# EAGLE schematic gemschematic_Chris_edits (EAGLE 9.6.2)
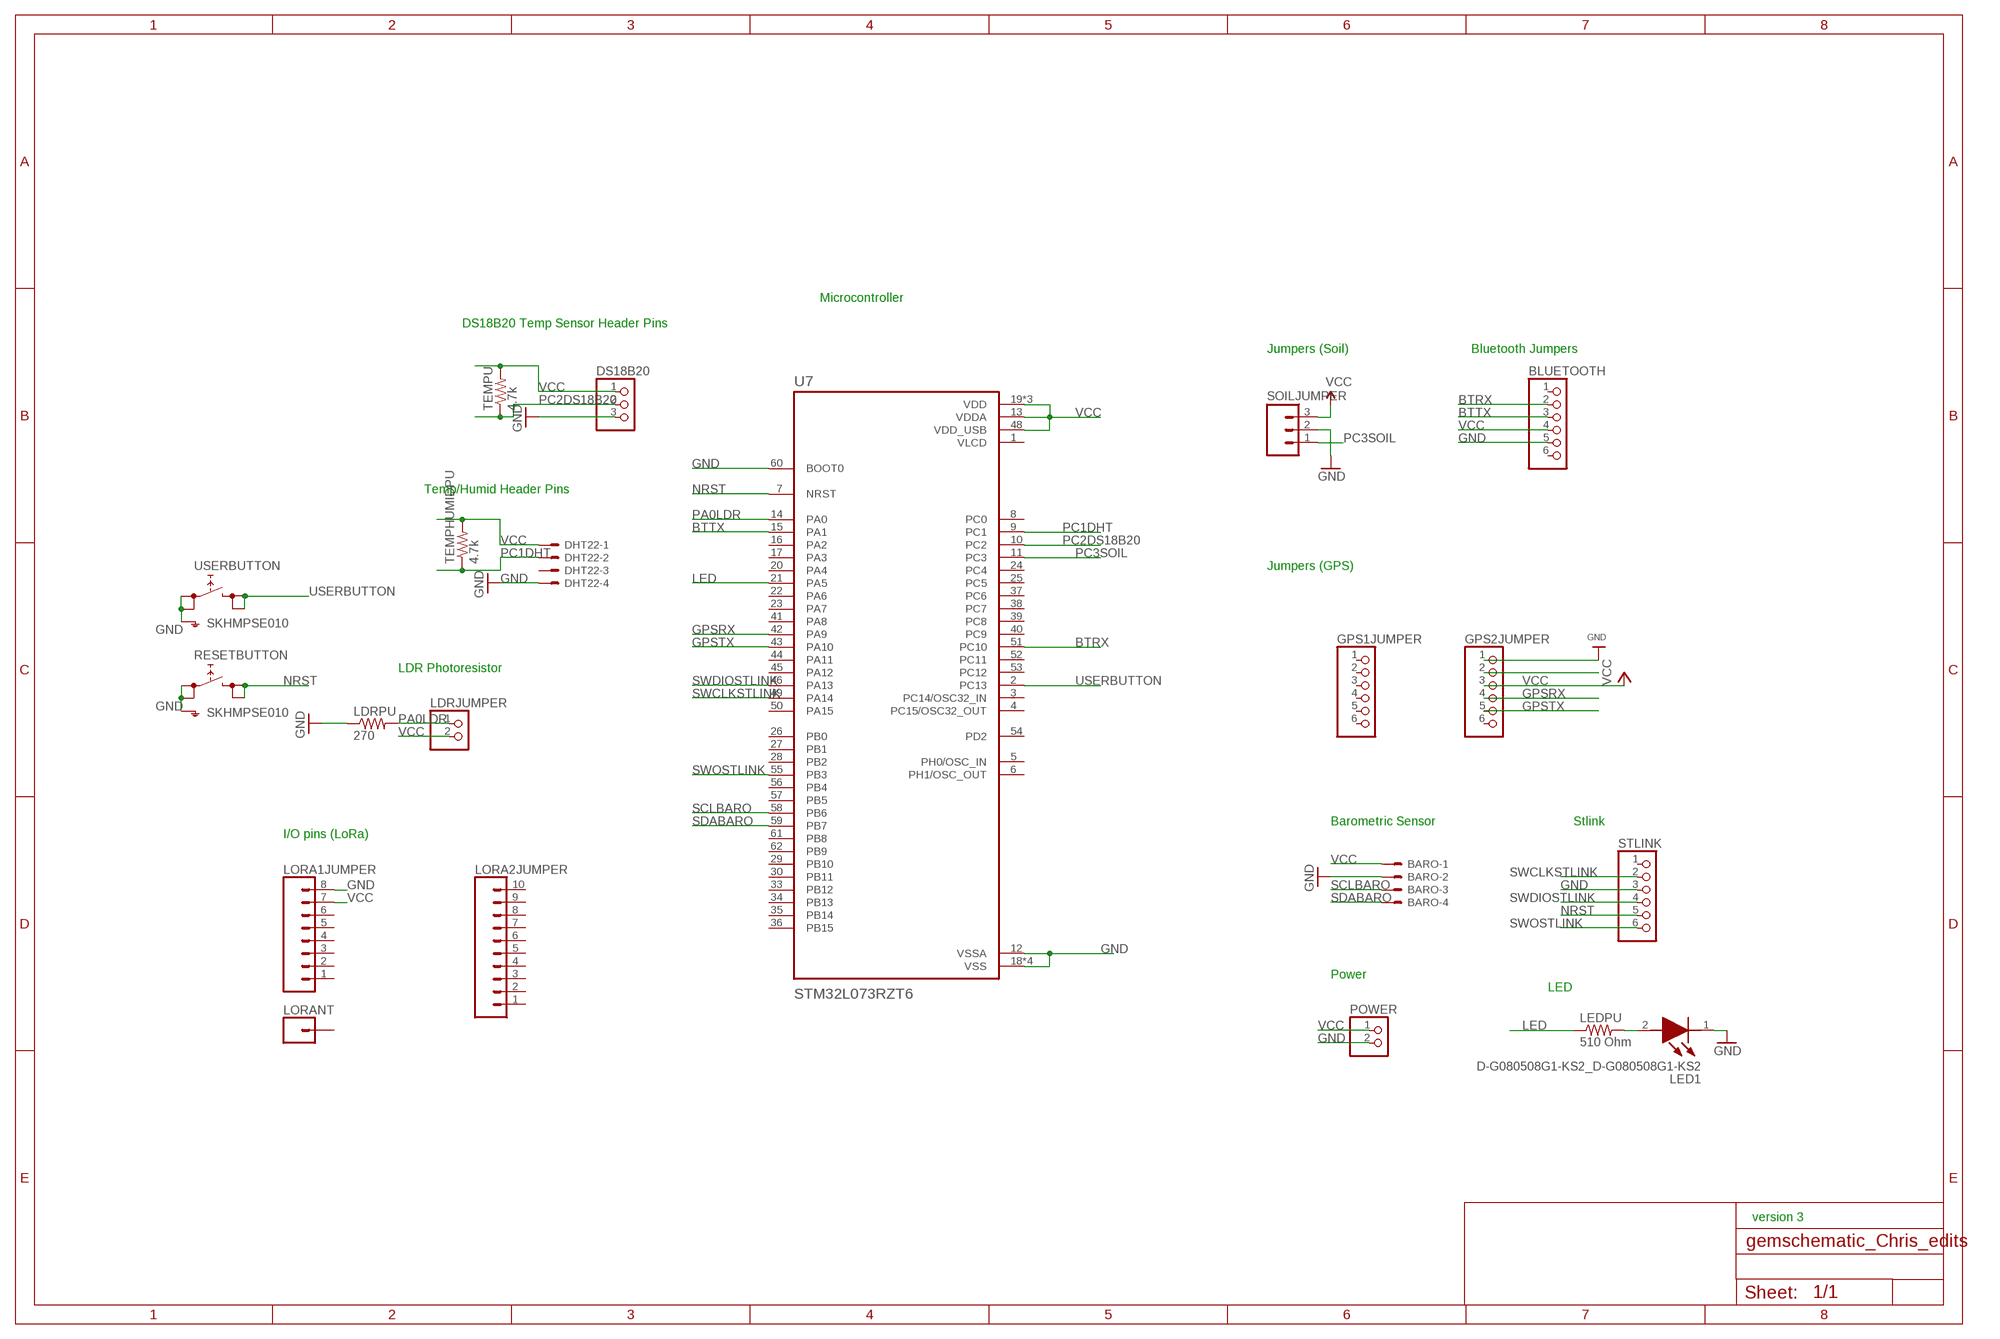
[diagram p0: schematic, sheet 1]

## Parts
BARO  22-23-2041  [22-23-2041]
BLUETOOTH  PINHD-1X6  [1X06]
DHT22  22-23-2041  [22-23-2041]
DS18B20  PINHD-1X3  [1X03]
GPS1JUMPER  HEADER-1X670MIL  [1X06_ROUND_70]
GPS2JUMPER  HEADER-1X670MIL  [1X06_ROUND_70]
LDRJUMPER  PINHD-1X2  [1X02]
LDRPU  270  R-US_M0805  [M0805]
LED1  D-G080508G1-KS2_D-G080508G1-KS2  [D-G080508G1-KS2_LEDC2012X85N]
LEDPU  510 Ohm  R-US_M0805  [M0805]
LORA1JUMPER  CONN_08NO_SILK_FEMALE_PTH  [1X08_NO_SILK]
LORA2JUMPER  CONN_10NO_SILK_PTH_FEMALE  [1X10_NO_SILK]
LORANT  CONN_01PTH_NO_SILK_YES_STOP  [1X01_NO_SILK]
POWER  PINHD-1X2  [1X02]
RESETBUTTON  SKHMPSE010  [SKHMPXE010]
SOILJUMPER  M03SCREW_LOCK  [SCREWTERMINAL-3.5MM-3_LOCK.007S]
STLINK  PINHD-1X6  [1X06]
TEMPHUMIDPU  4.7k  R-US_M0805  [M0805]
TEMPU  4.7k  R-US_M0805  [M0805]
U7  STM32L073RZT6  [QFP50P1200X1200X160-64N]
USERBUTTON  SKHMPSE010  [SKHMPXE010]

## Nets
1PPS: GPS2JUMPER.2
BTRX: BLUETOOTH.2 U7.51(PC10)
BTTX: BLUETOOTH.3 U7.15(PA1)
GND: BARO.2 BLUETOOTH.5 DHT22.4 DS18B20.3 GPS2JUMPER.1 LDRPU.1 LED1.1(K) LORA1JUMPER.8 POWER.2 RESETBUTTON.1(1.1) RESETBUTTON.2(1.2) RESETBUTTON.5(SH) SOILJUMPER.2 STLINK.3 U7.12(VSSA) U7.18(VSS) U7.31(VSS) U7.47(VSS) U7.60(BOOT0) U7.63(VSS) USERBUTTON.1(1.1) USERBUTTON.2(1.2) USERBUTTON.5(SH)
GPSRX: GPS2JUMPER.4 U7.42(PA9)
GPSTX: GPS2JUMPER.5 U7.43(PA10)
LED: LEDPU.1 U7.21(PA5)
N$1: LED1.2(A) LEDPU.2
NRST: RESETBUTTON.3(2.1) RESETBUTTON.4(2.2) STLINK.5 U7.7(NRST)
PA0LDR: LDRJUMPER.1 LDRPU.2 U7.14(PA0)
PC1DHT: DHT22.2 TEMPHUMIDPU.1 U7.9(PC1)
PC2DS18B20: DS18B20.2 TEMPU.1 U7.10(PC2)
PC3SOIL: SOILJUMPER.1 U7.11(PC3)
SCLBARO: BARO.3 U7.58(PB6)
SDABARO: BARO.4 U7.59(PB7)
SWCLKSTLINK: STLINK.2 U7.49(PA14)
SWDIOSTLINK: STLINK.4 U7.46(PA13)
SWOSTLINK: STLINK.6 U7.55(PB3)
USERBUTTON: U7.2(PC13) USERBUTTON.3(2.1) USERBUTTON.4(2.2)
VCC: BARO.1 BLUETOOTH.4 DHT22.1 DS18B20.1 GPS2JUMPER.3 LDRJUMPER.2 LORA1JUMPER.7 POWER.1 SOILJUMPER.3 TEMPHUMIDPU.2 TEMPU.2 U7.13(VDDA) U7.19(VDD) U7.32(VDD) U7.48(VDD_USB) U7.64(VDD)
Unconnected: BLUETOOTH.1 BLUETOOTH.6 DHT22.3 GPS1JUMPER.1 GPS1JUMPER.2 GPS1JUMPER.3 GPS1JUMPER.4 GPS1JUMPER.5 GPS1JUMPER.6 GPS2JUMPER.6 LORA1JUMPER.1 LORA1JUMPER.2 LORA1JUMPER.3 LORA1JUMPER.4 LORA1JUMPER.5 LORA1JUMPER.6 LORA2JUMPER.1 LORA2JUMPER.2 LORA2JUMPER.3 LORA2JUMPER.4 LORA2JUMPER.5 LORA2JUMPER.6 LORA2JUMPER.7 LORA2JUMPER.8 LORA2JUMPER.9 LORA2JUMPER.10 LORANT.1 STLINK.1 U7.3(PC14/OSC32_IN) U7.4(PC15/OSC32_OUT) U7.5(PH0/OSC_IN) U7.6(PH1/OSC_OUT) U7.8(PC0) U7.16(PA2) U7.17(PA3) U7.20(PA4) U7.22(PA6) U7.23(PA7) U7.24(PC4) U7.25(PC5) U7.26(PB0) U7.27(PB1) U7.28(PB2) U7.29(PB10) U7.30(PB11) U7.33(PB12) U7.34(PB13) U7.35(PB14) U7.36(PB15) U7.37(PC6) U7.38(PC7) U7.39(PC8) U7.40(PC9) U7.41(PA8) U7.44(PA11) U7.45(PA12) U7.50(PA15) U7.52(PC11) U7.53(PC12) U7.54(PD2) U7.56(PB4) U7.57(PB5) U7.61(PB8) U7.62(PB9)

## Notes on the sheet
- Microcontroller
- DS18B20 Temp Sensor Header Pins
- Jumpers (Soil) | Bluetooth Jumpers
- Temp/Humid Header Pins
- Jumpers (GPS)
- LDR Photoresistor
- Barometric Sensor | Stlink
- I/O pins (LoRa)
- Power
- LED
- version 3

## Power pins joined to a net without a drawn wire
VLCD: U7.1(VLCD)

## Library data of the parts
BARO DHT22 = con-molex:22-23-2041: .100" (2.54mm) Center Header - 4 Pin; MF: MOLEX; MPN: 22-23-2041; OC_FARNELL: 1462920; OC_NEWARK: 38C0355
BLUETOOTH STLINK = adafruit:PINHD-1X6: PIN HEADER
DS18B20 = adafruit:PINHD-1X3: PIN HEADER
GPS1JUMPER GPS2JUMPER = microbuilder:HEADER-1X6: PIN HEADER
LDRJUMPER POWER = pinhead:PINHD-1X2: PIN HEADER
LDRPU LEDPU TEMPHUMIDPU TEMPU = adafruit:R-US_: RESISTOR, American symbol
LED1 = ce-capstone-2022:D-G080508G1-KS2_D-G080508G1-KS2: Light Emitting Diodes (LED) Green 526~531nm 250~330mcd@5mA Top View 0805 RoHS Source: Datasheet <https://datasheet.lcsc.com/szlcsc/Wuxi-ARK-Tech-Elec-D-G080508G1-KS2_C107402.pdf>; DESCRIPTION: Light Emitting Diodes (LED) Green 526~531nm 250~330mcd@5mA Top View 0805 RoHS; HEIGHT: 0.85mm; MANUFACTURER_NAME: Wuxi ARK Tech Elec; MANUFACTURER_PART_NUMBER: D-G080508G1-KS2
LORA1JUMPER = SparkFun-Connectors:CONN_08: Multi connection point. Often used as Generic Header-pin footprint for 0.1 inch spaced/style header connections On any of the 0.1 inch spaced packages, you can populate with these: Break Away Headers - Straight <https://www.sparkfun.com/products/116> (PRT-00116) Break Away Male Headers - Right Angle <https://www.sparkfun.com/products/553> (PRT-00553) Female Headers <https://www.sparkfun.com/products/115> (PRT-00115) Break Away Headers - Machine Pin <https://www.sparkfun.com/products/117> (PRT-00117) Break Away Female Headers - Swiss Machine Pin <https://www.sparkfun.com/products/743> (PRT-00743) Arduino Stackable Header - 8 Pin <https://www.sparkfun.com/products/9279> (PRT-09279) For SCREWTERMINALS and SPRING TERMINALS visit here: Screw Terimnals on SparkFun.com <https://www.sparkfun.com/search/results?term=Screw+Terminals> (5mm/3.5mm/2.54mm spacing) This device is also useful as a general connection point to wire up your design to another part of your project. Our various solder wires solder well into these plated through hole pads. Hook-Up Wire - Assortment (Stranded, 22 AWG) <https://www.sparkfun.com/products/11375> (PRT-11375) Hook-Up Wire - Assortment (Solid Core, 22 AWG) <https://www.sparkfun.com/products/11367> (PRT-11367) View the entire wire category on our website here <https://www.sparkfun.com/categories/141> Special notes: Molex polarized connector foot print use with SKU : PRT-08231 with associated crimp pins and housings. 1MM SMD Version SKU: PRT-10208 NOTES ON THE VARIANTS LOCK and LOCK_LONGPADS... This footprint was designed to help hold the alignment of a through-hole component (i.e. 6-pin header) while soldering it into place. You may notice that each hole has been shifted either up or down by 0.005 of an inch from it's more standard position (which is a perfectly straight line). This slight alteration caused the pins (the squares in the middle) to touch the edges of the holes. Because they are alternating, it causes a "brace" to hold the component in place. 0.005 has proven to be the perfect amount of "off-center" position when using our standard breakaway headers. Although looks a little odd when you look at the bare footprint, once you have a header in there, the alteration is very hard to notice. Also,if you push a header all the way into place, it is covered up entirely on the bottom side.; PROD_ID: CONN-08438
LORA2JUMPER = SparkFun-Connectors:CONN_10: Multi connection point. Often used as Generic Header-pin footprint for 0.1 inch spaced/style header connections On any of the 0.1 inch spaced packages, you can populate with these: Break Away Headers - Straight <https://www.sparkfun.com/products/116> (PRT-00116) Break Away Male Headers - Right Angle <https://www.sparkfun.com/products/553> (PRT-00553) Female Headers <https://www.sparkfun.com/products/115> (PRT-00115) Break Away Headers - Machine Pin <https://www.sparkfun.com/products/117> (PRT-00117) Break Away Female Headers - Swiss Machine Pin <https://www.sparkfun.com/products/743> (PRT-00743) Arduino Stackable Header - 10 Pin <https://www.sparkfun.com/products/11376> (PRT-11376) For SCREWTERMINALS and SPRING TERMINALS visit here: Screw Terimnals on SparkFun.com <https://www.sparkfun.com/search/results?term=Screw+Terminals> (5mm/3.5mm/2.54mm spacing) This device is also useful as a general connection point to wire up your design to another part of your project. Our various solder wires solder well into these plated through hole pads. Hook-Up Wire - Assortment (Stranded, 22 AWG) <https://www.sparkfun.com/products/11375> (PRT-11375) Hook-Up Wire - Assortment (Solid Core, 22 AWG) <https://www.sparkfun.com/products/11367> (PRT-11367) View the entire wire category on our website here <https://www.sparkfun.com/categories/141> Special notes: Molex polarized connector foot print use with SKU : PRT-08231 with associated crimp pins and housings. 1MM SMD Version SKU: PRT-10208 NOTES ON THE VARIANTS LOCK and LOCK_LONGPADS... This footprint was designed to help hold the alignment of a through-hole component (i.e. 6-pin header) while soldering it into place. You may notice that each hole has been shifted either up or down by 0.005 of an inch from it's more standard position (which is a perfectly straight line). This slight alteration caused the pins (the squares in the middle) to touch the edges of the holes. Because they are alternating, it causes a "brace" to hold the component in place. 0.005 has proven to be the perfect amount of "off-center" position when using our standard breakaway headers. Although looks a little odd when you look at the bare footprint, once you have a header in there, the alteration is very hard to notice. Also,if you push a header all the way into place, it is covered up entirely on the bottom side.; PROD_ID: CONN-11563
LORANT = SparkFun-Connectors:CONN_01: Single connection point. Often used as Generic Header-pin footprint for 0.1 inch spaced/style header connections On any of the 0.1 inch spaced packages, you can populate with these: Break Away Headers - Straight <https://www.sparkfun.com/products/116> (PRT-00116) Break Away Male Headers - Right Angle <https://www.sparkfun.com/products/553> (PRT-00553) Female Headers <https://www.sparkfun.com/products/115> (PRT-00115) Break Away Headers - Machine Pin <https://www.sparkfun.com/products/117> (PRT-00117) Break Away Female Headers - Swiss Machine Pin <https://www.sparkfun.com/products/743> (PRT-00743) This device is also useful as a general connection point to wire up your design to another part of your project. Our various solder wires solder well into these plated through hole pads. Hook-Up Wire - Assortment (Stranded, 22 AWG) <https://www.sparkfun.com/products/11375> (PRT-11375) Hook-Up Wire - Assortment (Solid Core, 22 AWG) <https://www.sparkfun.com/products/11367> (PRT-11367) View the entire wire category on our website here <https://www.sparkfun.com/categories/141> Special notes: SMTSO-256-ET is a "flush mount" nut for a 4-40 screw. We mostly use this on specialty testbeds; it is a nice way to connect hardware to your PCB at an adjustable hieght. Also note, the SNAP packages are for using a snappable style connector. We sell a baggie of snaps and they are also used on two LilyPad designs: Snap Assortment - 30 pack (male and female) <https://www.sparkfun.com/products/11347> (DEV-11347) LilyPad Arduino SimpleSnap <https://www.sparkfun.com/products/10941> (DEV-10941) LilyPad SimpleSnap Protoboard <https://www.sparkfun.com/products/10940> (DEV-10940)
RESETBUTTON USERBUTTON = switch:SKHMP*E010: 6.2 X 6.5mm TACT Switch (SMD) Source: http://www3.alps.co.jp/WebObjects/catalog.woa/PDF/E/Switch/Tact/SKHM/SKHM.PDF
SOILJUMPER = SparkFun-Connectors:M03: Header 3 Standard 3-pin 0.1" header. Use with straight break away headers (SKU : PRT-00116), right angle break away headers (PRT-00553), swiss pins (PRT-00743), machine pins (PRT-00117), and female headers (PRT-00115). Molex polarized connector foot print use with SKU : PRT-08232 with associated crimp pins and housings.; PROD_ID: CONN-08288
U7 = STM32L073RZT6:STM32L073RZT6: None Check availability <https://pricing.snapeda.com/parts/STM32L073RZT6/STMicroelectronics/view-part?ref=eda>; AVAILABILITY: In Stock; DESCRIPTION: ARM® Cortex®-M0+ STM32L0 Microcontroller IC 32-Bit 32MHz 192KB (192K x 8) FLASH 64-LQFP (10x10); MF: STMicroelectronics; MP: STM32L073RZT6; PACKAGE: LQFP-64 STMicroelectronics; PRICE: None; PURCHASE-URL: https://pricing.snapeda.com/search/part/STM32L073RZT6/?ref=eda

## Net classes
0 default: width 0.152 mm, drill 0.305 mm
1 highpower: width 0.406 mm, drill 0.483 mm
2 lowpower: width 0.305 mm, drill 0.483 mm